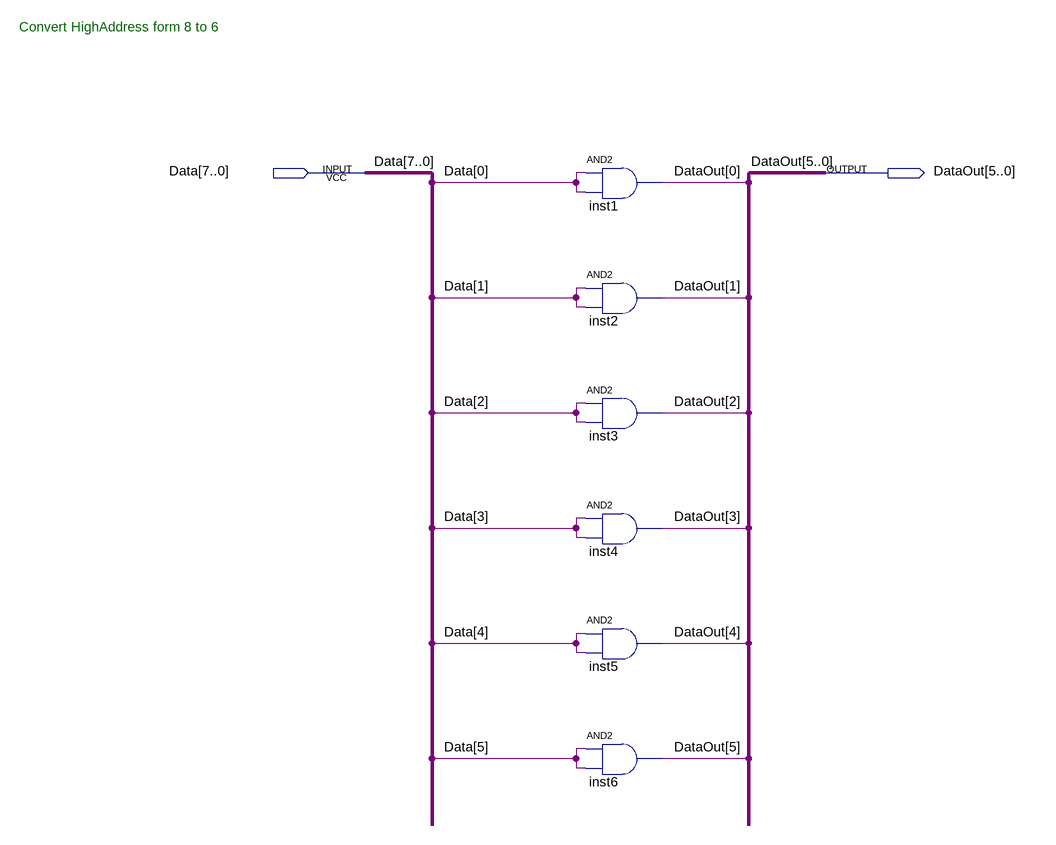
[diagram p0: schematic sheet]
// Quartus schematic 6to8.bdf as structural Verilog: 6 symbols, 2 pins
module \6to8  (
  input  [7:0] Data,
  output [5:0] DataOut
);

  and inst1 (DataOut[0], Data[0], Data[0]);
  and inst2 (DataOut[1], Data[1], Data[1]);
  and inst3 (DataOut[2], Data[2], Data[2]);
  and inst4 (DataOut[3], Data[3], Data[3]);
  and inst5 (DataOut[4], Data[4], Data[4]);
  and inst6 (DataOut[5], Data[5], Data[5]);

  // Notes on the sheet:
  //   Convert HighAddress form 8 to 6
endmodule
